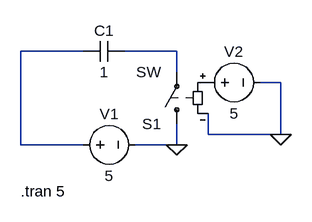
[diagram p0: schematic Draft5.asc]
Draft5.asc, the LTspice schematic file:
Version 4.1
SHEET 1 880 680
WIRE 80 112 -16 112
WIRE 224 112 144 112
WIRE 224 144 224 112
WIRE 384 160 352 160
WIRE 272 240 272 208
WIRE 384 240 384 160
WIRE 384 240 272 240
WIRE -16 256 -16 112
WIRE 80 256 -16 256
WIRE 224 256 224 224
WIRE 224 256 160 256
FLAG 224 256 0
FLAG 384 240 0
SYMBOL cap 144 96 R90
WINDOW 0 0 32 VBottom 2
WINDOW 3 32 32 VTop 2
SYMATTR InstName C1
SYMATTR Value 1
SYMBOL voltage 64 256 R270
WINDOW 0 32 56 VTop 2
WINDOW 3 -32 56 VBottom 2
WINDOW 123 0 0 Left 0
WINDOW 39 0 0 Left 0
SYMATTR InstName V1
SYMATTR Value 5
SYMBOL sw 224 240 R180
SYMATTR InstName S1
SYMBOL voltage 256 160 R270
WINDOW 0 32 56 VTop 2
WINDOW 3 -32 56 VBottom 2
WINDOW 123 0 0 Left 0
WINDOW 39 0 0 Left 0
SYMATTR InstName V2
SYMATTR Value 5
TEXT -16 328 Left 2 !.tran 5

The netlist it stands for:
* Draft5.asc
C1 N002 N001 1
V1 N001 0 5
S1 0 N002 P001 0 SW
V2 P001 0 5
.tran 5
.backanno
.end